# Altium project WalkMod A0.PrjPcb
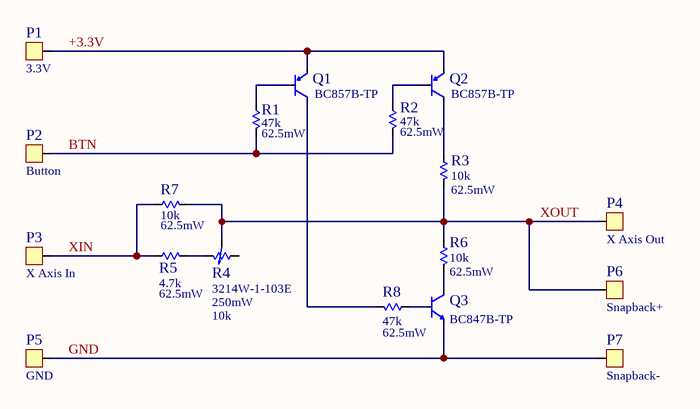
[diagram p0: WalkMod A0.SchDoc]
Author: TheComet; BoardRevision: A0; ProjectTitle: WalkMod
1 sheet, 18 parts. Net scope: global (net labels, ports and power ports of the same name join across sheets).
Board file: WalkMod A0.PcbDoc

## Sheet WalkMod A0.SchDoc
size A4; SheetNumber: 1; SheetTotal: 1

### Parts
P1  Name: 3.3V  [PAD_2X1.5_SQUARE]  (hidden comment: SMD Pad 1 pin)
P2  Name: Button  [PAD_2X1.5_SQUARE]  (hidden comment: SMD Pad 1 pin)
P3  Name: X Axis In  [PAD_2X1.5_SQUARE]  (hidden comment: SMD Pad 1 pin)
P4  Name: X Axis Out  [PAD_2X1.5_SQUARE]  (hidden comment: SMD Pad 1 pin)
P5  Name: GND  [PAD_2X1.5_SQUARE]  (hidden comment: SMD Pad 1 pin)
P6  Name: Snapback+  [PAD_1.8X0.95_SQUARE]  (hidden comment: SMD Pad 1 pin)
P7  Name: Snapback-  [PAD_1.8X0.95_SQUARE]  (hidden comment: SMD Pad 1 pin)
Q1  BC857B-TP  [BC8xx_SOT23-3_C]
Q2  BC857B-TP  [BC8xx_SOT23-3_C]
Q3  BC847B-TP  [BC8xx_SOT23-3_C]
R1  value 47k  Value2: 62.5mW  [RT0402_C]  (hidden comment: RT0402DRD0747KL)
R2  value 47k  Value2: 62.5mW  [RT0402_C]  (hidden comment: RT0402DRD0747KL)
R3  value 10k  Value2: 62.5mW  [AT0402_C]  (hidden comment: AT0402FRE0710KL)
R4  3214W-1-103E  value 10k  Value2: 250mW  [BOURNS_3214W_C]
R5  value 4.7k  Value2: 62.5mW  [RT0402_C]  (hidden comment: RT0402FRE074K7L)
R6  value 10k  Value2: 62.5mW  [AT0402_C]  (hidden comment: AT0402FRE0710KL)
R7  value 10k  Value2: 62.5mW  [AT0402_C]  (hidden comment: AT0402FRE0710KL)
R8  value 47k  Value2: 62.5mW  [RT0402_C]  (hidden comment: RT0402DRD0747KL)

### Nets
+3.3V: P1.1 Q1.E Q2.E
BTN: P2.1 R1.1 R2.1
GND: P5.1 P7.1 Q3.E
XIN: P3.1 R5.1 R7.2
XOUT: P4.1 P6.1 R3.2 R4.2 R6.1 R7.1
NetQ1_B: Q1.B R1.2
NetQ1_C: Q1.C R8.1
NetQ2_B: Q2.B R2.2
NetQ2_C: Q2.C R3.1
NetQ3_B: Q3.B R8.2
NetQ3_C: Q3.C R6.2
NetR4_3: R4.3 R5.2

Not connected (* = marked no-connect by the designer): R4 1

### Library data of the parts
P1-P7 = SMD Pad 1 pin: Single SMD Pad
Q1 Q2 = BC857B-TP: Bipolar (BJT) Transistor PNP 45 V 100 mA 200MHz 310 mW Surface Mount SOT-23; Type: BC857B-TP
Q3 = BC847B-TP: Bipolar (BJT) Transistor NPN 45 V 100 mA 100MHz 225 mW Surface Mount SOT-23; Type: BC847B-TP
R1 R2 R8 = RT0402DRD0747KL: 47 kOhms ±0.5% 0.063W, 1/16W Chip Resistor 0402 (1005 Metric) - Thin Film; Type: RT0402DRD0747KL
R3 R6 R7 = AT0402FRE0710KL: 10 kOhms ±1% 0.063W, 1/16W Chip Resistor 0402 (1005 Metric) Anti-Sulfur, Automotive AEC-Q200, Moisture Resistant Thin Film; Type: AT0402FRE0710KL
R4 = 3214W-1-103E: 10 kOhms 0.25W, 1/4W J Lead Surface Mount Trimmer Potentiometer Cermet 5.0 Turn Top Adjustment; Type: 3214W-1-103E
R5 = RT0402FRE074K7L: 4.7 kOhms ±1% 0.063W, 1/16W Chip Resistor 0402 (1005 Metric) - Thin Film; Type: RT0402FRE074K7L

## Assembly variants
Narrow: not fitted P1 P2 P3 P4 P5 P6 P7
Broad: not fitted P1 P2 P3 P4 P5 P6 P7 R7; alternate parts R5 -> RC0402FR-070RL